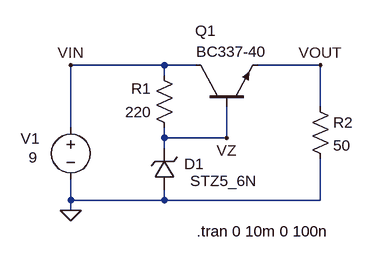
[diagram p0: schematic Linear_regulator.asc]
Linear_regulator.asc, the LTspice schematic file:
Version 4
SHEET 1 892 680
WIRE -208 -80 -352 -80
WIRE -160 -80 -208 -80
WIRE 32 -80 -64 -80
WIRE -208 -64 -208 -80
WIRE 32 -16 32 -80
WIRE -352 16 -352 -80
WIRE -208 32 -208 16
WIRE -112 32 -112 -16
WIRE -112 32 -208 32
WIRE -208 48 -208 32
WIRE -352 128 -352 96
WIRE -208 128 -208 112
WIRE -208 128 -352 128
WIRE 32 128 32 64
WIRE 32 128 -208 128
WIRE -352 144 -352 128
FLAG -352 144 0
FLAG -352 -80 VIN
FLAG 32 -80 VOUT
FLAG -112 32 VZ
SYMBOL voltage -352 0 R0
WINDOW 0 -77 33 Left 2
WINDOW 3 -65 62 Left 2
WINDOW 123 0 0 Left 0
WINDOW 39 0 0 Left 0
SYMATTR InstName V1
SYMATTR Value 9
SYMBOL res -192 32 R180
WINDOW 0 36 76 Left 2
WINDOW 3 36 40 Left 2
SYMATTR InstName R1
SYMATTR Value 220
SYMBOL zener -192 112 R180
WINDOW 0 -45 40 Left 2
WINDOW 3 -127 14 Left 2
SYMATTR InstName D1
SYMATTR Value STZ5_6N
SYMATTR Description Diode
SYMATTR Type diode
SYMBOL npn -160 -16 R270
WINDOW 0 117 -1 VRight 2
WINDOW 3 85 1 VRight 2
SYMATTR InstName Q1
SYMATTR Value BC337-40
SYMBOL res 16 -32 R0
SYMATTR InstName R2
SYMATTR Value 50
TEXT -158 176 Left 2 !.tran 0 10m 0 100n

The netlist it stands for:
* Linear_regulator.asc
V1 VIN 0 9
R1 VZ VIN 220
D1 0 VZ STZ5_6N
Q1 VIN VZ VOUT 0 BC337-40
R2 VOUT 0 50
.model D D
.lib standard.dio
.model NPN NPN
.model PNP PNP
.lib standard.bjt
.tran 0 10m 0 100n
.backanno
.end